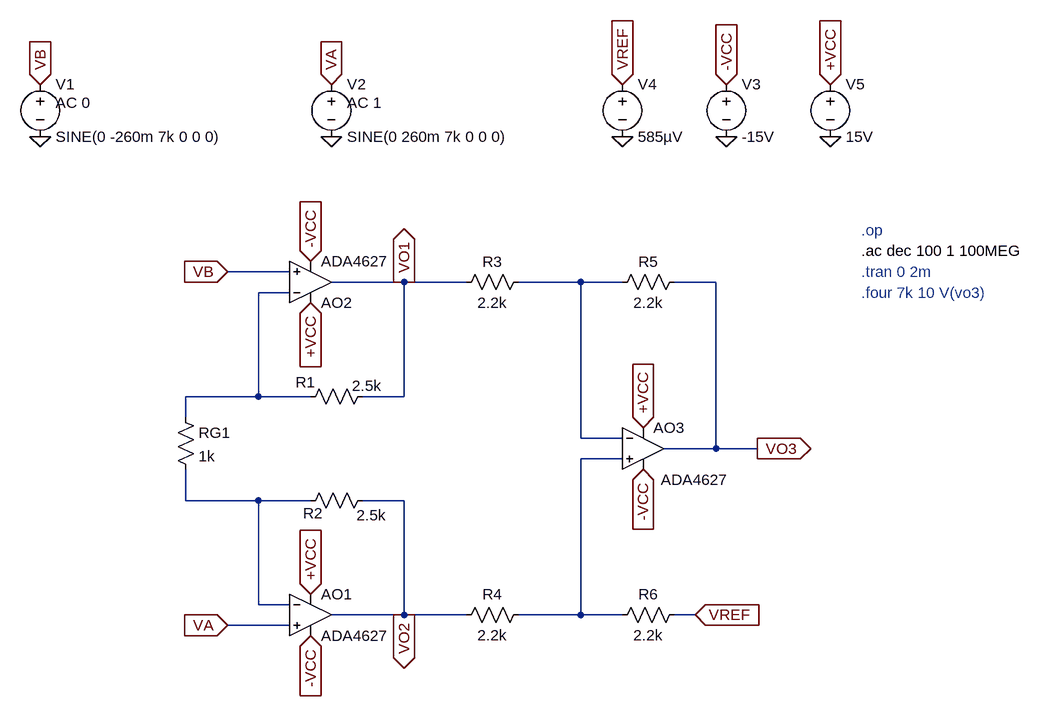
[diagram p0: schematic AI_3AO_V-V.asc]
AI_3AO_V-V.asc, the LTspice schematic file:
Version 4.1
SHEET 1 1108 680
WIRE -32 -144 -128 -144
WIRE 144 -128 32 -128
WIRE 240 -128 144 -128
WIRE 416 -128 320 -128
WIRE 480 -128 416 -128
WIRE 624 -128 560 -128
WIRE -32 -112 -80 -112
WIRE -80 48 -80 -112
WIRE -80 48 -192 48
WIRE 0 48 -80 48
WIRE 144 48 144 -128
WIRE 144 48 80 48
WIRE -192 80 -192 48
WIRE 416 112 416 -128
WIRE 480 112 416 112
WIRE 624 128 624 -128
WIRE 624 128 544 128
WIRE 688 128 624 128
WIRE 480 144 416 144
WIRE -192 208 -192 160
WIRE -80 208 -192 208
WIRE 0 208 -80 208
WIRE 144 208 80 208
WIRE -80 368 -80 208
WIRE -32 368 -80 368
WIRE 144 384 144 208
WIRE 144 384 32 384
WIRE 240 384 144 384
WIRE 416 384 416 144
WIRE 416 384 320 384
WIRE 480 384 416 384
WIRE 592 384 560 384
WIRE -32 400 -128 400
FLAG -128 -144 VB
IOPIN -128 -144 In
FLAG -128 400 VA
IOPIN -128 400 In
FLAG 0 -160 -VCC
IOPIN 0 -160 In
FLAG 0 -96 +VCC
IOPIN 0 -96 In
FLAG 0 416 -VCC
IOPIN 0 416 In
FLAG 0 352 +VCC
IOPIN 0 352 In
FLAG 592 384 VREF
IOPIN 592 384 In
FLAG 144 -128 VO1
IOPIN 144 -128 Out
FLAG 144 384 VO2
IOPIN 144 384 Out
FLAG 512 160 -VCC
IOPIN 512 160 In
FLAG 512 96 +VCC
IOPIN 512 96 In
FLAG 688 128 VO3
IOPIN 688 128 Out
FLAG -416 -352 0
FLAG -416 -432 VB
IOPIN -416 -432 In
FLAG 32 -352 0
FLAG 32 -432 VA
IOPIN 32 -432 In
FLAG 640 -352 0
FLAG 800 -352 0
FLAG 800 -432 +VCC
IOPIN 800 -432 In
FLAG 640 -432 -VCC
IOPIN 640 -432 In
FLAG 480 -352 0
FLAG 480 -432 VREF
IOPIN 480 -432 In
DATAFLAG 624 128 ""
SYMBOL OpAmps\\ADA4627 0 320 R0
SYMATTR InstName AO1
SYMBOL OpAmps\\ADA4627 0 -64 M180
SYMATTR InstName AO2
SYMBOL OpAmps\\ADA4627 512 64 R0
WINDOW 3 27 112 Left 2
SYMATTR InstName AO3
SYMBOL res 96 32 R90
WINDOW 0 10 104 VBottom 2
WINDOW 3 -16 9 VTop 2
SYMATTR InstName R1
SYMATTR Value 2.5k
SYMBOL res 96 192 R90
WINDOW 0 51 92 VBottom 2
WINDOW 3 23 2 VTop 2
SYMATTR InstName R2
SYMATTR Value 2.5k
SYMBOL res -208 64 R0
SYMATTR InstName RG1
SYMATTR Value 1k
SYMBOL res 336 -144 R90
WINDOW 0 0 56 VBottom 2
WINDOW 3 32 56 VTop 2
SYMATTR InstName R3
SYMATTR Value 2.2k
SYMBOL res 336 368 R90
WINDOW 0 0 56 VBottom 2
WINDOW 3 32 56 VTop 2
SYMATTR InstName R4
SYMATTR Value 2.2k
SYMBOL res 576 -144 R90
WINDOW 0 0 56 VBottom 2
WINDOW 3 32 56 VTop 2
SYMATTR InstName R5
SYMATTR Value 2.2k
SYMBOL res 576 368 R90
WINDOW 0 0 56 VBottom 2
WINDOW 3 32 56 VTop 2
SYMATTR InstName R6
SYMATTR Value 2.2k
SYMBOL voltage -416 -448 R0
WINDOW 123 24 44 Left 2
WINDOW 39 0 0 Left 0
SYMATTR Value2 AC 0
SYMATTR InstName V1
SYMATTR Value SINE(0 -260m 7k 0 0 0)
SYMBOL voltage 32 -448 R0
WINDOW 123 24 44 Left 2
WINDOW 39 0 0 Left 0
SYMATTR Value2 AC 1
SYMATTR InstName V2
SYMATTR Value SINE(0 260m 7k 0 0 0)
SYMBOL voltage 640 -448 R0
WINDOW 123 0 0 Left 0
WINDOW 39 0 0 Left 0
SYMATTR InstName V3
SYMATTR Value -15V
SYMBOL voltage 480 -448 R0
WINDOW 123 0 0 Left 0
WINDOW 39 0 0 Left 0
SYMATTR InstName V4
SYMATTR Value 585µV
SYMBOL voltage 800 -448 R0
WINDOW 123 24 44 Left 2
WINDOW 39 0 0 Left 0
SYMATTR InstName V5
SYMATTR Value 15V
TEXT 848 -176 Left 2 !.ac dec 100 1 100MEG
TEXT 848 -144 Left 2 ;.tran 0 2m
TEXT 848 -208 Left 2 ;.op
TEXT 848 -112 Left 2 ;.four 7k 10 V(vo3)

The netlist it stands for:
* AI_3AO_V-V.asc
X§AO1 VA N004 +VCC -VCC VO2 ADA4627  ; pins In+ In- V+ V- OUT
X§AO2 VB N002 +VCC -VCC VO1 ADA4627  ; pins In+ In- V+ V- OUT
X§AO3 N003 N001 +VCC -VCC VO3 ADA4627  ; pins In+ In- V+ V- OUT
R1 VO1 N002 2.5k
R2 VO2 N004 2.5k
RG1 N002 N004 1k
R3 N001 VO1 2.2k
R4 N003 VO2 2.2k
R5 VO3 N001 2.2k
R6 VREF N003 2.2k
V1 VB 0 SINE(0 -260m 7k 0 0 0) AC 0
V2 VA 0 SINE(0 260m 7k 0 0 0) AC 1
V3 -VCC 0 -15V
V4 VREF 0 585µV
V5 +VCC 0 15V
.ac dec 100 1 100MEG
* .tran 0 2m
* .op
* .four 7k 10 V(vo3)
.backanno
.end